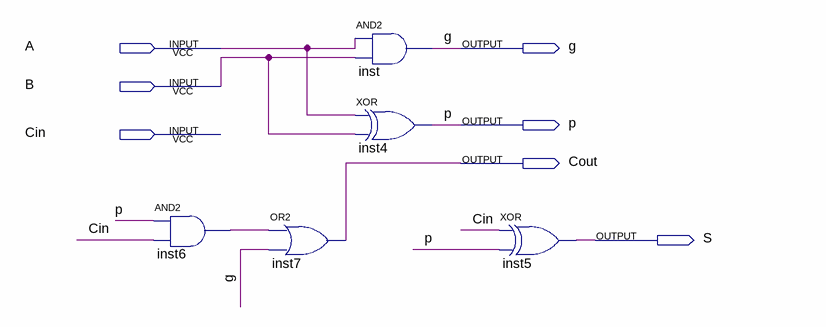
[diagram p0: schematic sheet]
// Quartus schematic FullAdderWithPG.bdf as structural Verilog: 5 symbols, 7 pins
module FullAdderWithPG (
  input  A,
  input  B,
  input  Cin,
  output g,
  output p,
  output Cout,
  output S
);

  wire inst6_out;

  and inst6 (inst6_out, p, Cin);
  or inst7 (Cout, inst6_out, g);
  and inst (g, A, B);
  xor inst4 (p, A, B);
  xor inst5 (S, Cin, p);
endmodule
